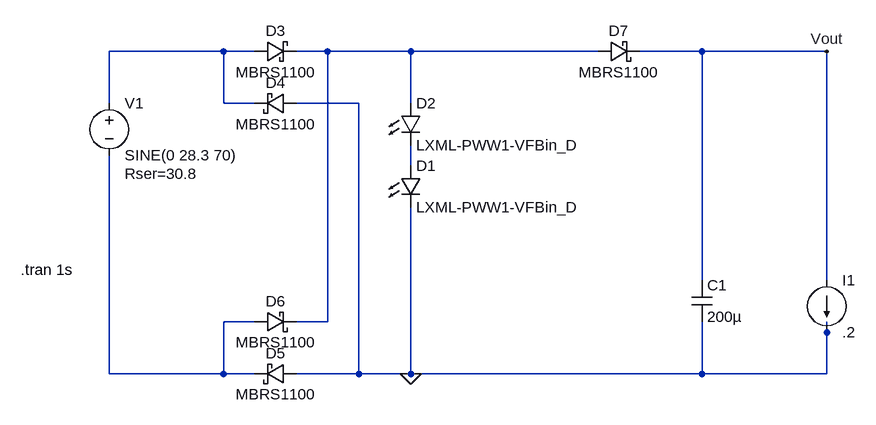
[diagram p0: schematic simple2.asc]
simple2.asc, the LTspice schematic file:
Version 4
SHEET 1 2624 1080
WIRE 64 48 -112 48
WIRE 112 48 64 48
WIRE 224 48 176 48
WIRE 352 48 224 48
WIRE 640 48 352 48
WIRE 800 48 704 48
WIRE 992 48 800 48
WIRE -112 128 -112 48
WIRE 64 128 64 48
WIRE 112 128 64 128
WIRE 272 128 176 128
WIRE 352 128 352 48
WIRE 352 224 352 192
WIRE 800 400 800 48
WIRE 992 400 992 48
WIRE 112 464 64 464
WIRE 224 464 224 48
WIRE 224 464 176 464
WIRE 992 480 992 464
WIRE -112 544 -112 208
WIRE 64 544 64 464
WIRE 64 544 -112 544
WIRE 112 544 64 544
WIRE 272 544 272 128
WIRE 272 544 176 544
WIRE 352 544 352 288
WIRE 352 544 272 544
WIRE 800 544 800 464
WIRE 800 544 352 544
WIRE 992 544 992 480
WIRE 992 544 800 544
FLAG 992 48 Vout
FLAG 352 544 0
SYMBOL voltage -112 112 R0
WINDOW 123 0 0 Left 0
WINDOW 39 24 124 Left 2
SYMATTR SpiceLine Rser=30.8
SYMATTR InstName V1
SYMATTR Value SINE(0 28.3 70)
SYMBOL LED 336 128 R0
SYMATTR InstName D2
SYMATTR Value LXML-PWW1-VFBin_D
SYMATTR Description Diode
SYMATTR Type diode
SYMBOL LED 336 224 R0
SYMATTR InstName D1
SYMATTR Value LXML-PWW1-VFBin_D
SYMATTR Description Diode
SYMATTR Type diode
SYMBOL schottky 112 64 R270
WINDOW 0 32 32 VTop 2
WINDOW 3 0 32 VBottom 2
SYMATTR InstName D3
SYMATTR Value MBRS1100
SYMATTR Description Diode
SYMATTR Type diode
SYMBOL schottky 176 112 R90
WINDOW 0 0 32 VBottom 2
WINDOW 3 32 32 VTop 2
SYMATTR InstName D4
SYMATTR Value MBRS1100
SYMATTR Description Diode
SYMATTR Type diode
SYMBOL schottky 176 528 R90
WINDOW 0 0 32 VBottom 2
WINDOW 3 32 32 VTop 2
SYMATTR InstName D5
SYMATTR Value MBRS1100
SYMATTR Description Diode
SYMATTR Type diode
SYMBOL schottky 112 448 M90
WINDOW 0 0 32 VBottom 2
WINDOW 3 32 32 VTop 2
SYMATTR InstName D6
SYMATTR Value MBRS1100
SYMATTR Description Diode
SYMATTR Type diode
SYMBOL cap 784 400 R0
SYMATTR InstName C1
SYMATTR Value 200µ
SYMBOL load2 992 400 R0
SYMATTR InstName I1
SYMATTR Value .2
SYMBOL schottky 640 32 M90
WINDOW 0 0 32 VBottom 2
WINDOW 3 32 32 VTop 2
SYMATTR InstName D7
SYMATTR Value MBRS1100
SYMATTR Description Diode
SYMATTR Type diode
TEXT -248 384 Left 2 !.tran 1s

The netlist it stands for:
* simple2.asc
V1 N001 N004 SINE(0 28.3 70) Rser=30.8
D2 N002 N003 LXML-PWW1-VFBin_D
D1 N003 0 LXML-PWW1-VFBin_D
D3 N001 N002 MBRS1100
D4 0 N001 MBRS1100
D5 0 N004 MBRS1100
D6 N004 N002 MBRS1100
C1 Vout 0 200µ
I1 Vout 0 .2
D7 N002 Vout MBRS1100
.model D D
.lib standard.dio
.tran 1s
.backanno
.end